# EAGLE design ZULU-T868-TX-Prototype (EAGLE 6.4)
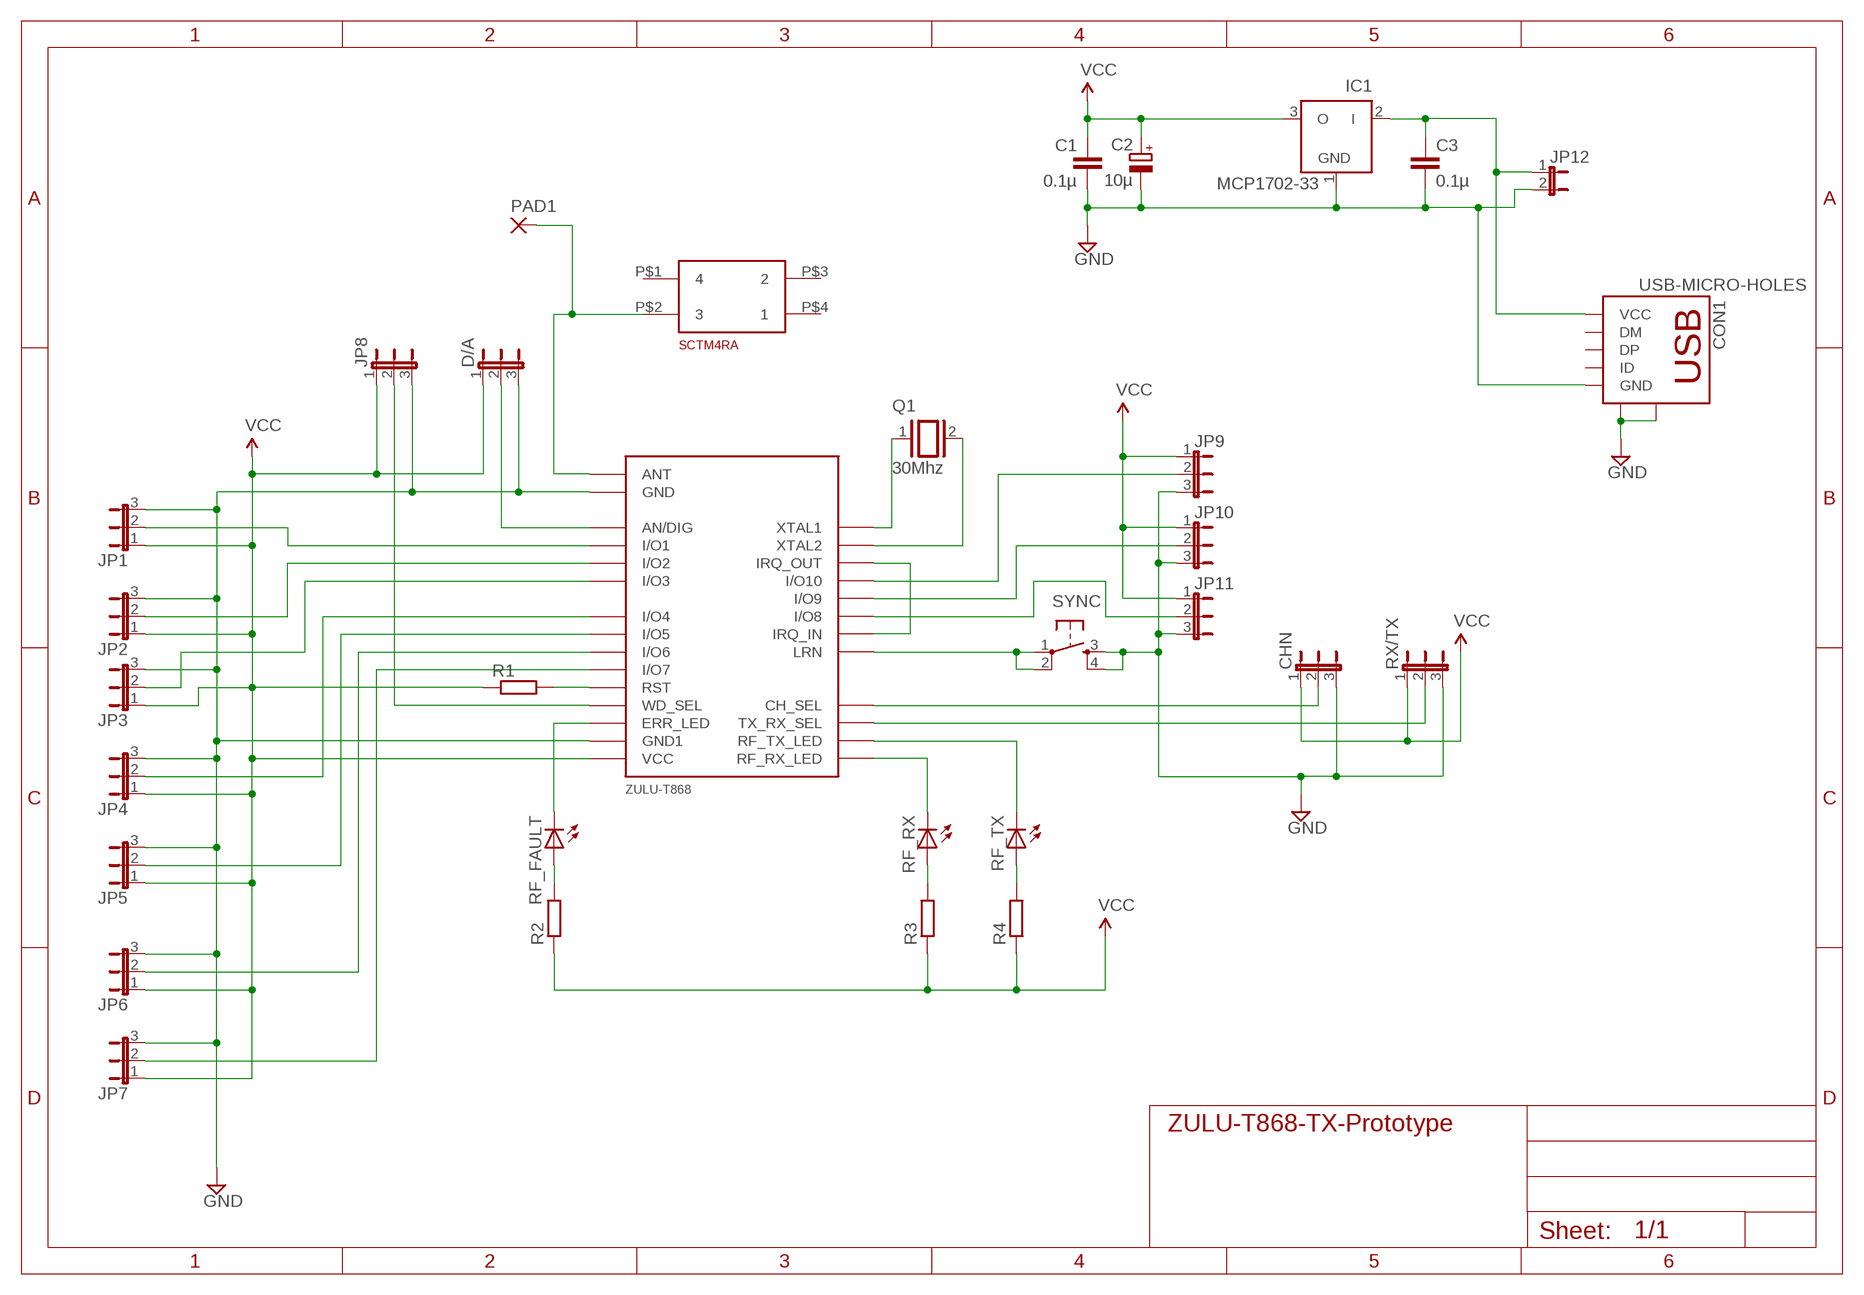
[diagram p0: schematic, sheet 1]

## Parts
C1  0.1µ  C-EUC0805  [C0805]
C2  10µ  CPOL-EUE1.8-4  [E1,8-4]
C3  0.1µ  C-EUC0805  [C0805]
CHN  JP2E  [JP2]
CON1  USB-MICRO-HOLES  [MICRO-USB-B-HOLES]
D/A  JP2E  [JP2]
IC1  MCP1702-33  MCP1702Z  [TO92]
JP1  JP2E  [JP2]
JP2  JP2E  [JP2]
JP3  JP2E  [JP2]
JP4  JP2E  [JP2]
JP5  JP2E  [JP2]
JP6  JP2E  [JP2]
JP7  JP2E  [JP2]
JP8  JP2E  [JP2]
JP9  JP2E  [JP2]
JP10  JP2E  [JP2]
JP11  JP2E  [JP2]
JP12  JP1E  [JP1]
PAD1  1,6/0,8  [1,6/0,8]
Q1  30Mhz  XTAL/S  [QS]
R1  R-EU_M0805  [M0805]
R2  R-EU_M0805  [M0805]
R3  R-EU_M0805  [M0805]
R4  R-EU_M0805  [M0805]
RF_FAULT  LEDCHIPLED_0805  [CHIPLED_0805]
RF_RX  LEDCHIPLED_0805  [CHIPLED_0805]
RF_TX  LEDCHIPLED_0805  [CHIPLED_0805]
RX/TX  JP2E  [JP2]
SYNC  TAC_SWITCHPTH  [TACTILE-PTH]
U$1  SCTM4RA  [SCTM4RA]
U$2  ZULU-T868  [ZULU-T-MODULE]

## Nets
GND: C1.2 C2.- C3.2 CHN.3 CON1.P$5(GND) CON1.SHIELD1 CON1.SHIELD2 D/A.3 IC1.1(GND) JP1.3 JP2.3 JP3.3 JP4.3 JP5.3 JP6.3 JP7.3 JP8.3 JP9.3 JP10.3 JP11.3 JP12.2 RX/TX.3 SYNC.3 SYNC.4 U$2.P$2(GND) U$2.P$15(GND1)
N$1: D/A.2 U$2.P$3(AN/DIG)
N$2: Q1.1 U$2.P$30(XTAL1)
N$3: Q1.2 U$2.P$29(XTAL2)
N$4: R1.2 U$2.P$12(RST)
N$5: CHN.2 U$2.P$20(CH_SEL)
N$6: U$2.P$24(IRQ_IN) U$2.P$28(IRQ_OUT)
N$7: RX/TX.2 U$2.P$19(TX_RX_SEL)
N$8: SYNC.1 SYNC.2 U$2.P$23(LRN)
N$9: RF_FAULT.C U$2.P$14(ERR_LED)
N$10: JP2.2 U$2.P$5(I/O2)
N$11: JP1.2 U$2.P$4(I/O1)
N$12 [power]: C3.1 CON1.P$1(VCC) IC1.2(I) JP12.1
N$13: R3.2 RF_RX.A
N$14: R4.2 RF_TX.A
N$15: RF_RX.C U$2.P$17(RF_RX_LED)
N$16: RF_TX.C U$2.P$18(RF_TX_LED)
N$17: JP6.2 U$2.P$10(I/O6)
N$18: R2.2 RF_FAULT.A
N$19: JP3.2 U$2.P$6(I/O3)
N$20: JP4.2 U$2.P$8(I/O4)
N$21: JP5.2 U$2.P$9(I/O5)
N$22: JP7.2 U$2.P$11(I/O7)
N$23: JP11.2 U$2.P$25(I/O8)
N$24: JP10.2 U$2.P$26(I/O9)
N$25: JP9.2 U$2.P$27(I/O10)
N$26: PAD1.1(P) U$1.P$2 U$2.P$1(ANT)
N$27: JP8.2 U$2.P$13(WD_SEL)
VCC: C1.1 C2.+ CHN.1 D/A.1 IC1.3(O) JP1.1 JP2.1 JP3.1 JP4.1 JP5.1 JP6.1 JP7.1 JP8.1 JP9.1 JP10.1 JP11.1 R1.1 R2.1 R3.1 R4.1 RX/TX.1 U$2.P$16(VCC)
Unconnected: CON1.P$2(DM) CON1.P$3(DP) CON1.P$4(ID) U$1.P$1 U$1.P$3 U$1.P$4

## Library data of the parts
C1 C3 = resistor:C-EU: CAPACITOR, European symbol
C2 = resistor:CPOL-EU: POLARIZED CAPACITOR, European symbol
CHN D/A JP1-JP11 RX/TX = jumper:JP2E: JUMPER
CON1 = Youritronics:USB-MICRO
IC1 = JeeLabs:MCP1702: 200 mA, Low Power Low Dropout Voltage Regulator
JP12 = jumper:JP1E: JUMPER
PAD1 = wirepad:1,6/0,8: THROUGH-HOLE PAD
Q1 = special:XTAL/S: CRYSTAL
R1-R4 = resistor:R-EU_: RESISTOR, European symbol
RF_FAULT RF_RX RF_TX = adafruit:LED: LED OSRAM: - CHIPLED LG R971, LG N971, LY N971, LG Q971, LY Q971, LO R971, LY R971 LH N974, LH R974 LS Q976, LO Q976, LY Q976 LO Q996 - Hyper CHIPLED LW Q18S LB Q993, LB Q99A, LB R99A - SideLED LS A670, LO A670, LY A670, LG A670, LP A670 LB A673, LV A673, LT A673, LW A673 LH A674 LY A675 LS A676, LA A676, LO A676, LY A676, LW A676 LS A679, LY A679, LG A679 - Hyper Micro SIDELED® LS Y876, LA Y876, LO Y876, LY Y876 LT Y87S - SmartLED LW L88C, LW L88S LB L89C, LB L89S, LG L890 LS L89K, LO L89K, LY L89K LS L896, LA L896, LO L896, LY L896 - TOPLED LS T670, LO T670, LY T670, LG T670, LP T670 LSG T670, LSP T670, LSY T670, LOP T670, LYG T670 LG T671, LOG T671, LSG T671 LB T673, LV T673, LT T673, LW T673 LH T674 LS T676, LA T676, LO T676, LY T676, LB T676, LH T676, LSB T676, LW T676 LB T67C, LV T67C, LT T67C, LS T67K, LO T67K, LY T67K, LW E67C LS E67B, LA E67B, LO E67B, LY E67B, LB E67C, LV E67C, LT E67C LW T67C LS T679, LY T679, LG T679 LS T770, LO T770, LY T770, LG T770, LP T770 LB T773, LV T773, LT T773, LW T773 LH T774 LS E675, LA E675, LY E675, LS T675 LS T776, LA T776, LO T776, LY T776, LB T776 LHGB T686 LT T68C, LB T68C - Hyper Mini TOPLED® LB M676 - Mini TOPLED Santana® LG M470 LS M47K, LO M47K, LY M47K Source: http://www.osram.convergy.de/
SYNC = SparkFun-Electromechanical:TAC_SWITCH: Momentary Switch Button commonly used for reset or general input. Spark Fun Electronics SKU : COM-00097 SMT- SWCH-08247
U$1 = Cube42:SCTM4RA
U$2 = Cube42:ZULU-T868

## Net classes
1 power: width 0.381 mm, clearance 0.254 mm

## Board
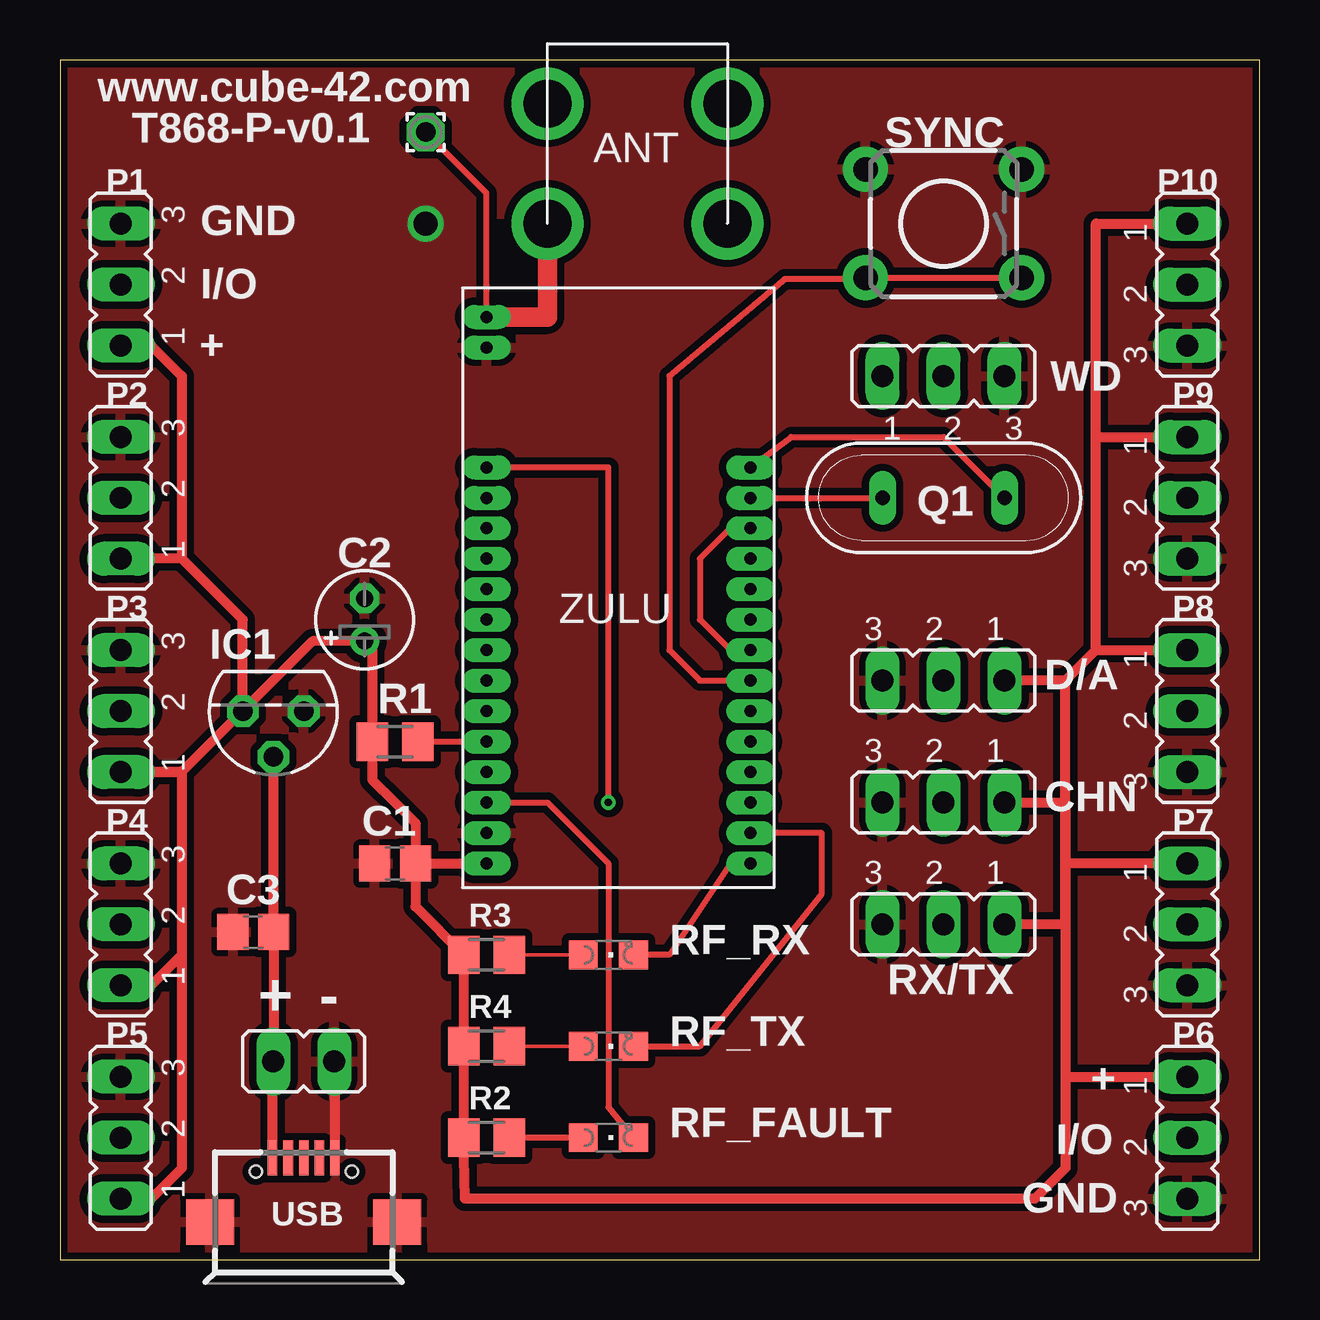
[diagram p1: board, top side]
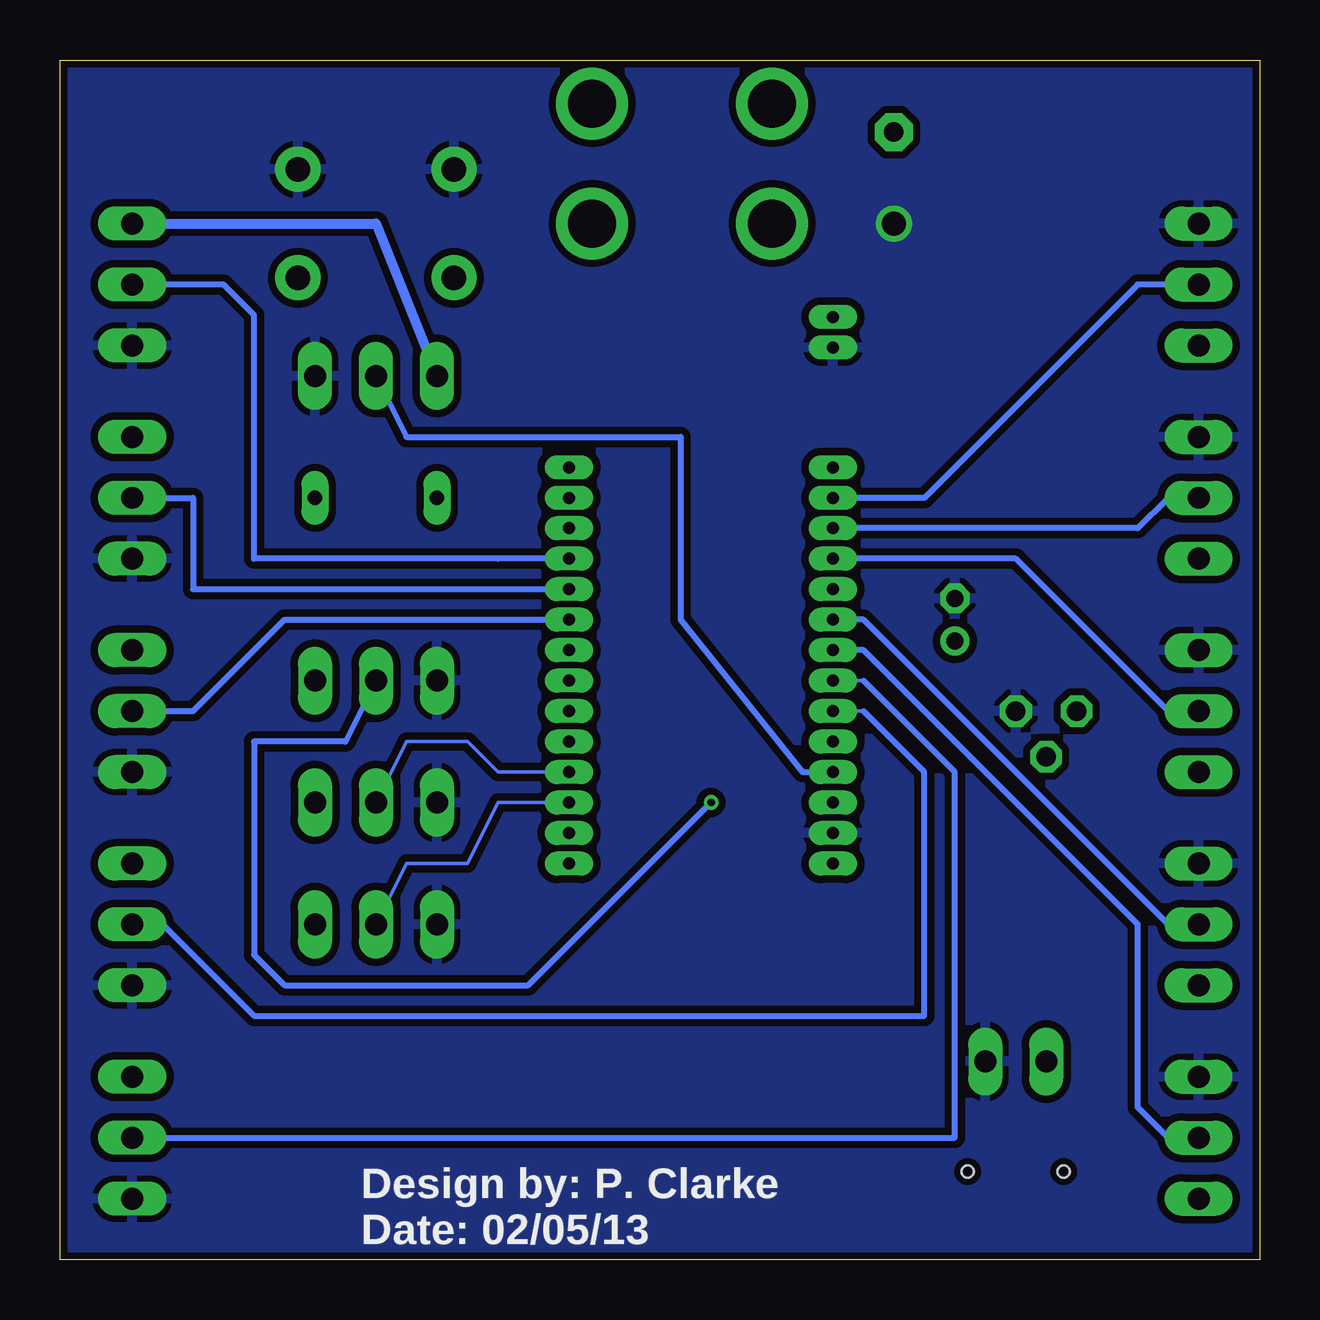
[diagram p2: board, bottom side, seen from below]

Size 50 x 50 mm. Coordinates in mm from the lower left corner, seen from the top.
Outline: 0,0 50,0 50,50 0,50 0,0
Copper layers (1*16): Top 0.035mm / dielectric 1.5mm / Bottom 0.035mm
Design rules "Fusion_eagle_rule_v1.1": minimum track width 6mil, minimum drill 12mil, track to track 6mil, track to pad 6mil, pad to pad 6mil, via to via 6mil, smd to smd 0mil, copper to edge 10mil, drill to drill 10mil, minimum pad ring 10mil, minimum via ring 6mil, stop-mask expansion 2mil, vias tented up to drill 100mil, thermal gap 10mil

### Footprints (pad centres in the part's own frame; a part is rotated, then mirrored left to right if it is on the bottom)
C0805 = smd 1.3 x 1.5: 1 -0.85,0; 2 0.85,0
E1,8-4 = drill 0.711 pad 1.168: + -0.889,0 | drill 0.711 pad 1.168 octagon: - 0.889,0
JP2 = drill 0.914 long: 1 -2.54,0; 2 0,0; 3 2.54,0
MICRO-USB-B-HOLES = smd 0.4 x 1.45: P$1 -1.3,2.67; P$2 -0.65,2.67; P$3 0,2.67; P$4 0.65,2.67; P$5 1.3,2.67 | smd 2 x 1.9: SHIELD1 -3.9,0; SHIELD2 3.9,0 | hole 0.5: -2,2.1; 2,2.1
TO92 = drill 0.813 octagon: 1 -1.27,0; 2 0,1.905; 3 1.27,0
JP1 = drill 0.914 long: 1 0,-1.27; 2 0,1.27
1,6/0,8 = drill 0.813 pad 1.6 octagon: 1 0,0
QS = drill 0.61 long: 1 -2.54,0; 2 2.54,0
M0805 = smd 1.3 x 1.6: 1 -0.95,0; 2 0.95,0
CHIPLED_0805 = smd 1.2 x 1.2: A 0,-1.05; C 0,1.05
TACTILE-PTH = drill 1.016 pad 1.88: 1 -3.251,2.261; 2 3.251,2.261; 3 -3.251,-2.261; 4 3.251,-2.261
SCTM4RA = drill 2: P$1 0,5; P$2 0,0; P$3 7.5,5; P$4 7.5,0
ZULU-T-MODULE = drill 0.5 long: P$1 0,22.78; P$2 0,21.51; P$3 0,16.51; P$4 0,15.24; P$5 0,13.97; P$6 0,12.7; P$7 0,11.43; P$8 0,10.16; P$9 0,8.89; P$10 0,7.62; P$11 0,6.35; P$12 0,5.08; P$13 0,3.81; P$14 0,2.54; P$15 0,1.27; P$16 0,0; P$17 11,0; P$18 11,1.27; P$19 11,2.54; P$20 11,3.81; P$21 11,5.08; P$22 11,6.35; P$23 11,7.62; P$24 11,8.89; P$25 11,10.16; P$26 11,11.43; P$27 11,12.7; P$28 11,13.97; P$29 11,15.24; P$30 11,16.51

### Placement (x,y rotation side)
C1  13.97,16.51 180 top
C2  12.7,26.67 90 top
C3  8.06,13.65 180 top
CHN  36.83,19.05 180 top
CON1  10.16,1.57 0 top
D/A  36.83,24.13 180 top
IC1  8.89,22.86 180 top
JP1  2.54,40.64 90 top
JP2  2.54,31.75 90 top
JP3  2.54,22.86 90 top
JP4  2.54,13.97 90 top
JP5  2.54,5.08 90 top
JP6  46.99,5.08 270 top
JP7  46.99,13.97 270 top
JP8  36.83,36.83 0 top
JP9  46.99,40.64 270 top
JP10  46.99,31.75 270 top
JP11  46.99,22.86 270 top
JP12  10.16,8.26 270 top
PAD1  15.24,46.99 0 top
Q1  36.83,31.75 180 top
R1  13.97,21.59 0 top
R2  17.78,5.08 0 top
R3  17.78,12.7 0 top
R4  17.78,8.89 0 top
RF_FAULT  22.86,5.08 270 top
RF_RX  22.86,12.7 270 top
RF_TX  22.86,8.89 270 top
RX/TX  36.83,13.97 180 top
SYNC  36.83,43.18 180 top
U$1  20.32,43.18 0 top
U$2  17.78,16.51 0 top

### Tracks (layer width: path | path; a pad name or v marks a point on that pad's centre or on a via)
GND  (via drill 1)
  Top 0.406: CON1.P$5 11.46,8.22 JP12.2
  other vias: 15.24,43.18
  pour Bottom (isolate 0.305): -1.27,50.8 -1.27,-1.27 50.8,-1.27 50.8,50.8
  pour Top (isolate 0.305): -2.54,52.07 -2.54,-2.54 53.34,-2.54 53.34,-1.27 53.34,52.07
N$1  (via drill 0.3)
  Top 0.152: U$2.P$3
  Top 0.254: U$2.P$3 22.86,33.02 v22.86,19.05
  Bottom 0.254: v22.86,19.05 30.48,11.43 40.64,11.43 41.91,12.7 41.91,21.59 38.1,21.59 D/A.2
N$2
  Top 0.254: U$2.P$30 30.48,34.29 36.83,34.29 Q1.1
N$3
  Top 0.254: U$2.P$29 Q1.2
N$4
  Top 0.254: R1.2 U$2.P$12 | U$2.P$12
N$5
  Bottom 0.152: CHN.2 35.56,21.59 33.02,21.59 31.75,20.32 29.21,20.32 U$2.P$20
N$6
  Top 0.254: U$2.P$24 27.94,25.4 26.67,26.67 26.67,29.21 27.94,30.48 U$2.P$28
N$7
  Bottom 0.152: RX/TX.2 35.56,16.51 33.02,16.51 31.75,19.05 29.21,19.05 U$2.P$19
N$8
  Top 0.254: SYNC.1 SYNC.2 32.75,40.87 30.21,40.87 25.4,36.83 25.4,25.4 26.67,24.13 U$2.P$23
N$9
  Top 0.254: U$2.P$14 20.32,19.05 22.86,16.51 22.86,6.35 RF_FAULT.C | U$2.P$14
N$10
  Bottom 0.152: JP2.2 3.81,31.75 | U$2.P$5
  Bottom 0.254: U$2.P$5 5.08,30.48 3.81,31.75
N$11
  Bottom 0.254: JP1.2 5.08,40.64 13.97,31.75 U$2.P$4
N$12
  Top 0.406: IC1.2 8.89,14.94 C3.1 8.91,8.28 JP12.1 8.86,8.22 CON1.P$1
N$13
  Top 0.152: RF_RX.A R3.2
N$14
  Top 0.152: RF_TX.A R4.2
N$15
  Top 0.254: RF_RX.C 25.4,12.7 27.94,16.51 U$2.P$17
N$16
  Top 0.254: RF_TX.C 26.67,8.89 31.75,15.24 31.75,17.78 U$2.P$18
N$17
  Bottom 0.152: 16.51,24.13 U$2.P$10
  Bottom 0.254: 16.51,24.13 12.7,20.32 12.7,5.08 JP6.2 | U$2.P$10
N$18
  Top 0.254: RF_FAULT.A R2.2
N$19
  Bottom 0.152: JP3.2 3.81,22.86 | U$2.P$6
  Bottom 0.254: U$2.P$6 10.16,29.21 3.81,22.86
N$20
  Bottom 0.152: JP4.2 3.81,13.97 | U$2.P$8
  Bottom 0.254: U$2.P$8 16.51,26.67 3.81,13.97
N$21
  Bottom 0.152: JP5.2 3.81,5.08 | U$2.P$9
  Bottom 0.254: U$2.P$9 16.51,25.4 5.08,13.97 5.08,6.35 3.81,5.08
N$22
  Bottom 0.152: 16.51,22.86 U$2.P$11 | JP7.2 45.72,13.97
  Bottom 0.254: 16.51,22.86 13.97,20.32 13.97,10.16 41.91,10.16 45.72,13.97 | U$2.P$11
N$23
  Bottom 0.152: 29.21,26.67 U$2.P$25
  Bottom 0.254: 29.21,26.67 40.64,26.67 44.45,22.86 JP11.2
N$24
  Bottom 0.152: 29.21,27.94 U$2.P$26
  Bottom 0.254: 29.21,27.94 44.45,27.94 44.45,31.75 JP10.2
N$25
  Bottom 0.254: U$2.P$27 31.75,29.21 41.91,29.21 41.91,39.37 43.18,40.64 JP9.2
N$26
  Top 0.254: U$2.P$1 17.78,44.45 PAD1.1
  Top 0.813: U$2.P$1 20.32,39.29 U$1.P$2
N$27
  Bottom 0.152: U$2.P$13
  Bottom 0.254: U$2.P$13 19.05,20.32 24.13,26.67 24.13,34.29 35.56,34.29 JP8.2
VCC
  Top 0.406: 41.91,13.97 RX/TX.1 | 41.91,19.05 CHN.1 41.91,19.05 | 41.91,7.62 JP6.1 | 41.91,13.97 41.91,7.62 | 41.91,24.13 D/A.1 | 41.91,13.97 41.91,16.51 | 41.91,16.51 41.91,19.05 | 41.91,19.05 41.91,24.13 | 41.91,24.13 43.18,25.4 | 43.18,25.4 JP11.1 | 43.18,34.29 JP10.1 | 43.18,25.4 43.18,34.29 | JP9.1 43.18,43.18 43.18,34.29 | C1.1 U$2.P$16 | U$2.P$16 | 41.91,19.05 41.91,16.51 | 41.91,16.51 41.91,13.97 | 41.91,13.97 41.91,7.62 | 41.91,7.62 41.91,3.81 40.64,2.54 16.88,2.54 R2.1 R4.1 R3.1 14.82,14.71 C1.1 | C1.1 14.82,18.2 13.97,19.05 13.02,20 R1.1 13.02,25.46 C2.+ 10.54,25.78 IC1.3 | IC1.3 5.08,20.32 | 5.08,20.32 JP3.1 5.08,20.32 | 5.08,20.32 5.08,12.7 | 5.08,12.7 3.81,11.43 | 3.81,11.43 JP4.1 3.81,11.43 | 3.81,11.43 5.08,12.7 | 5.08,12.7 5.08,3.81 3.81,2.54 JP5.1 | IC1.3 7.62,26.67 5.08,29.21 | 5.08,29.21 JP2.1 | JP1.1 3.81,38.1 5.08,36.83 5.08,29.21 | JP7.1 41.91,16.51
  Bottom 0.152: JP9.1 45.72,43.18
  Bottom 0.406: JP8.1 36.83,43.18 45.72,43.18

### Text on the board
tPlace: T868-P-v0.1
_tsilk: www.cube-42.com | P1 | P10 | GND | I/O | + | P2 | WD | P9 | P3 | P8 | P4 | P7 | RF_RX | + | - | P5 | RF_TX | P6 | + | RF_FAULT | I/O | GND | USB
_bsilk: Design by: P. Clarke / Date: 02/05/13